# Altium schematic sheet ESC_30A.SchDoc
size A
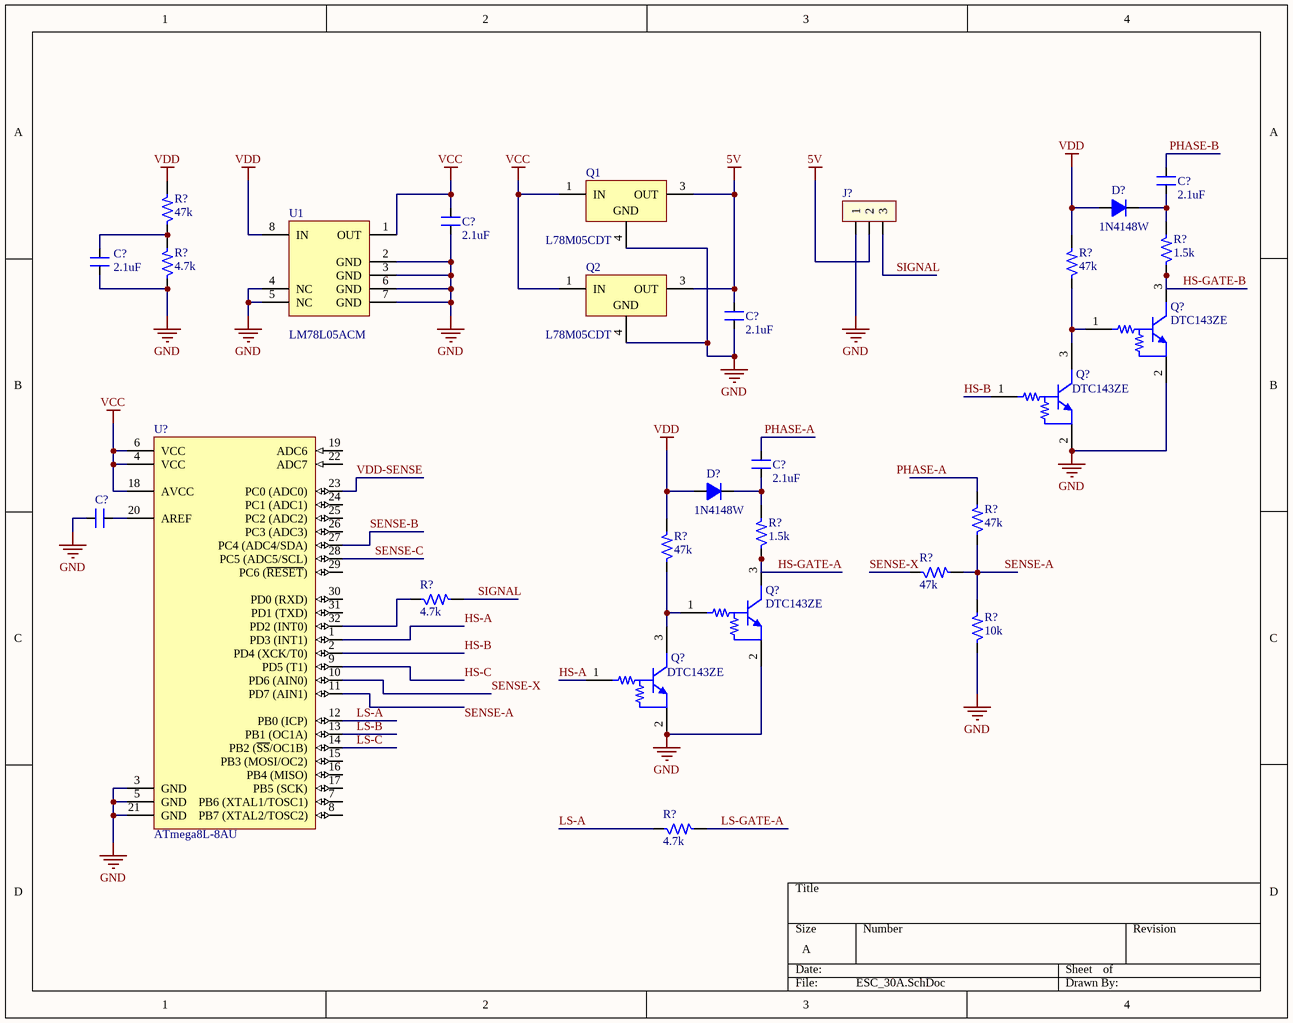
[diagram p0: ESC_30A.SchDoc]

## Parts
(Parts that share a designator on the sheet are numbered #1, #2 ... from top to bottom, then left to right.)
C?#1  2.1uF  [CN2]
C?#2  2.1uF  [CN2]
C?#3  2.1uF  [CN2]
C?#4  2.1uF  [CN2]
C?#5  2.1uF  [CN2]
C?#6  (no value)  [CN2]
D?#1  1N4148W  [D1A]
D?#2  1N4148W  [D1A]
J?  (no value)  [JP3]
Q1  L78M05CDT  [STM-TO252-3_A_V]
Q2  L78M05CDT  [STM-TO252-3_A_V]
Q?#1  DTC143ZE  [ONSC-SC-75-3-463-01_V]
Q?#2  DTC143ZE  [ONSC-SC-75-3-463-01_V]
Q?#3  DTC143ZE  [ONSC-SC-75-3-463-01_V]
Q?#4  DTC143ZE  [ONSC-SC-75-3-463-01_V]
R?#1  47k  [SM-1206]
R?#2  1.5k  [SM-1206]
R?#3  4.7k  [SM-1206]
R?#4  47k  [SM-1206]
R?#5  47k  [SM-1206]
R?#6  1.5k  [SM-1206]
R?#7  47k  [SM-1206]
R?#8  47k  [SM-1206]
R?#9  4.7k  [SM-1206]
R?#10  10k  [SM-1206]
R?#11  4.7k  [SM-1206]
U1  LM78L05ACM  [D0008A_N]
U?  ATmega8L-8AU  [32A_L]

## Nets
5V: C?#4.2 J?.2 Q1.3(OUT) Q2.3(OUT)
GND: C?#2.1 C?#3.1 C?#4.1 C?#6.2 J?.1 Q1.4(GND) Q2.4(GND) Q?#1.2(E) Q?#2.2(E) Q?#3.2(E) Q?#4.2(E) R?#3.1 R?#10.1 U1.2(GND) U1.3(GND) U1.4(NC) U1.5(NC) U1.6(GND) U1.7(GND) U?.3(GND) U?.5(GND) U?.21(GND)
VCC: C?#2.2 Q1.1(IN) Q2.1(IN) U1.1(OUT) U?.4(VCC) U?.6(VCC) U?.18(AVCC)
VDD: D?#1.1(A) D?#2.1(A) R?#1.2 R?#4.2 R?#7.2 U1.8(IN)
HS-A: Q?#4.1(B) U?.1(PD3_(INT1))
HS-B: Q?#2.1(B) U?.2(PD4_(XCK/T0))
HS-C: U?.9(PD5_(T1))
HS-GATE-A: Q?#3.3(C) R?#6.1
HS-GATE-B: Q?#1.3(C) R?#2.1
LS-A: R?#11.1 U?.12(PB0_(ICP))
LS-B: U?.13(PB1_(OC1A))
LS-C: U?.14(PB2_(~{SS}/OC1B))
LS-GATE-A: R?#11.2
PHASE-A: C?#5.2
PHASE-B: C?#1.2
SENSE-A: R?#5.1 R?#8.2 R?#10.2
SENSE-B: U?.27(PC4_(ADC4/SDA))
SENSE-C: U?.28(PC5_(ADC5/SCL))
SENSE-X: R?#8.1 U?.10(PD6_(AIN0))
SIGNAL: J?.3 R?#9.2
VDD-SENSE: U?.23(PC0_(ADC0))
NetC?#1_1: C?#1.1 D?#1.2(K) R?#2.2
NetC?#3_2: C?#3.2 R?#1.1 R?#3.2
NetC?#5_1: C?#5.1 D?#2.2(K) R?#6.2
NetC?#6_1: C?#6.1 U?.20(AREF)
NetQ?#1_1: Q?#1.1(B) Q?#2.3(C) R?#4.1
NetQ?#3_1: Q?#3.1(B) Q?#4.3(C) R?#7.1
NetR?#9_1: R?#9.1 U?.32(PD2_(INT0))

Not connected (* = marked no-connect by the designer): R?#5 2; U? 7(PB6_(XTAL1/TOSC1)) 8(PB7_(XTAL2/TOSC2)) 11(PD7_(AIN1)) 15(PB3_(MOSI/OC2)) 16(PB4_(MISO)) 17(PB5_(SCK)) 19(ADC6) 22(ADC7) 24(PC1_(ADC1)) 25(PC2_(ADC2)) 26(PC3_(ADC3)) 29(PC6_(~{RESET})) 30(PD0_(RXD)) 31(PD1_(TXD))

## Notes on the sheet
- Labels drawn without touching a wire or pin: PHASE-A, SENSE-A

## Library data of the parts
C?#1-C?#6 = CN2: Cap np 104 => 105pF; Value: 0.1uF
D?#1 D?#2 = D1A: Diode 1A; Value: 1N4007
J? = JP3: Jumper 3; Value: J3
Q1 Q2 = CMP-2000-06530-1: Precision Regulator, 0.5 A, 5 V Output, 0 to 150 degC, 3-Pin DPAK (TO252), RoHS, Tube; Manufacturer: STMicroelectronics; No. of Pins: 3Pins; SVHC: NoSVHC(17-Dec-2015); Input Voltage Max: 35V; Linear Regulator Case Style: TO-252; Output Voltage Nom.: 5V; Output Current: 500mA; Input Voltage Min: 10V; Manufacturer URL: http://www.st.com/; Operating Temperature Min: 0°C; Package Description: 3-Pin Transistor Outline, Body 6.5 x 6.1 mm, Pitch 2.28 mm; Package Reference: TO252; Datasheet Version: Rev. 20, 06/2014; Packaging: Each; Mounting Technology: SurfaceMount; Operating Temperature Max: 150°C; Datasheet URL: http://www.st.com/content/ccc/resource/technical/document/datasheet/d7/5f/dc/5c/d5/b6/48/7c/CD00000447.pdf/files/CD00000447.pdf/jcr:content/translations/en.CD00000447.pdf
Q?#1-Q?#4 = CMP-0630-00196-1: Digital Transistor (BRT), R1=4.7 kOhm, R2=47 kOhm, NPN Transistor, 3-Pin SC-75, Pb-Free, Tape and Reel; PartNumber: DTC143ZET1G; Manufacturer: On Semiconductor; hFE Min: 80; V(BR)CEO Min (V): 50; IC Continuous (A): 0.1; ComponentLink1URL: http://www.onsemi.com/; ComponentLink2Description: Datasheet; DatasheetVersion: Rev. 4; Packing: Tape and Reel; ComponentLink1Description: Manufacturer URL; PackageDescription: 3-Pin Small Outline Transistor, Body 1.6 x 0.8 mm, Pitch 0.5 mm; Mounting Technology: Surface Mount; Polarity: NPN; PackageReference: SC-75-3-463-01; RoHS: TRUE; PackageVersion: Rev. F, 07/2005; ComponentLink2URL: http://www.onsemi.cn/pub_link/Collateral/DTC143Z-D.PDF; ComponentLink3Description: Package Specification; R1/R2 Typ: 0.1; ComponentLink3URL: http://www.onsemi.com/pub_link/Collateral/463-01.PDF
R?#1-R?#11 = R: Resistor 1/4W; Value: R1/4W - 1K
U1 = CMP-0062-02632-2: 3-Terminal Positive Regulator, 5 Vout, 8-pin Narrow SOIC, 2500 Reel; Manufacturer: Texas Instruments; PartNumber: LM78L05ACMX/NOPB; PowerWise: N; High-Reliability: Y; CompType: LDO IC; Code_IPC: SOIC127P600-8; Code_JEDEC: MS-012-AA; PackageReference: D0008A; RoHS: Y; ComponentLink1URL: http://www.ti.com/general/docs/lit/getliterature.tsp?genericPartNumber=LM78L05&fileType=pdf; PinCount: 8; PackageDescription: SOIC Narrow, 4.9 x 3.9 x 1.45mm, 8 Lead, 1.27mm Pitch; ComponentLink1Description: Datasheet URL
U? = CMP-0095-00569-1: 8-bit AVR Microcontroller, 2.7-5.5V, 8MHz, 8KB Flash, 512 Bytes EEPROM, 1KB SRAM, 32-pin TQFP, Industrial Grade (-40°C to 85°C); PackageVersion: revC, Oct-2010; PackageDescription: 32-Lead, 7x7x1.0 mm Body, 0.8mm Lead Pitch, Thin Profile Plastic Quad Flat Package (TQFP); ComponentLink1URL: http://www.atmel.com/; PackageReference: 32A; ComponentLink2URL: http://www.atmel.com/dyn/resources/prod_documents/doc2486.pdf; ComponentLink1Description: Manufacturer URL; DatasheetVersion: revZ, Feb-2011; ComponentLink3Description: ATmega8(L) Summary; ComponentLink2Description: ATmega8(L); Code_JEDEC: MS-026-ABA; ComponentLink3URL: http://www.atmel.com/dyn/resources/prod_documents/2486S.pdf